# EAGLE schematic CAN Transceiver (EAGLE 9.0.1)
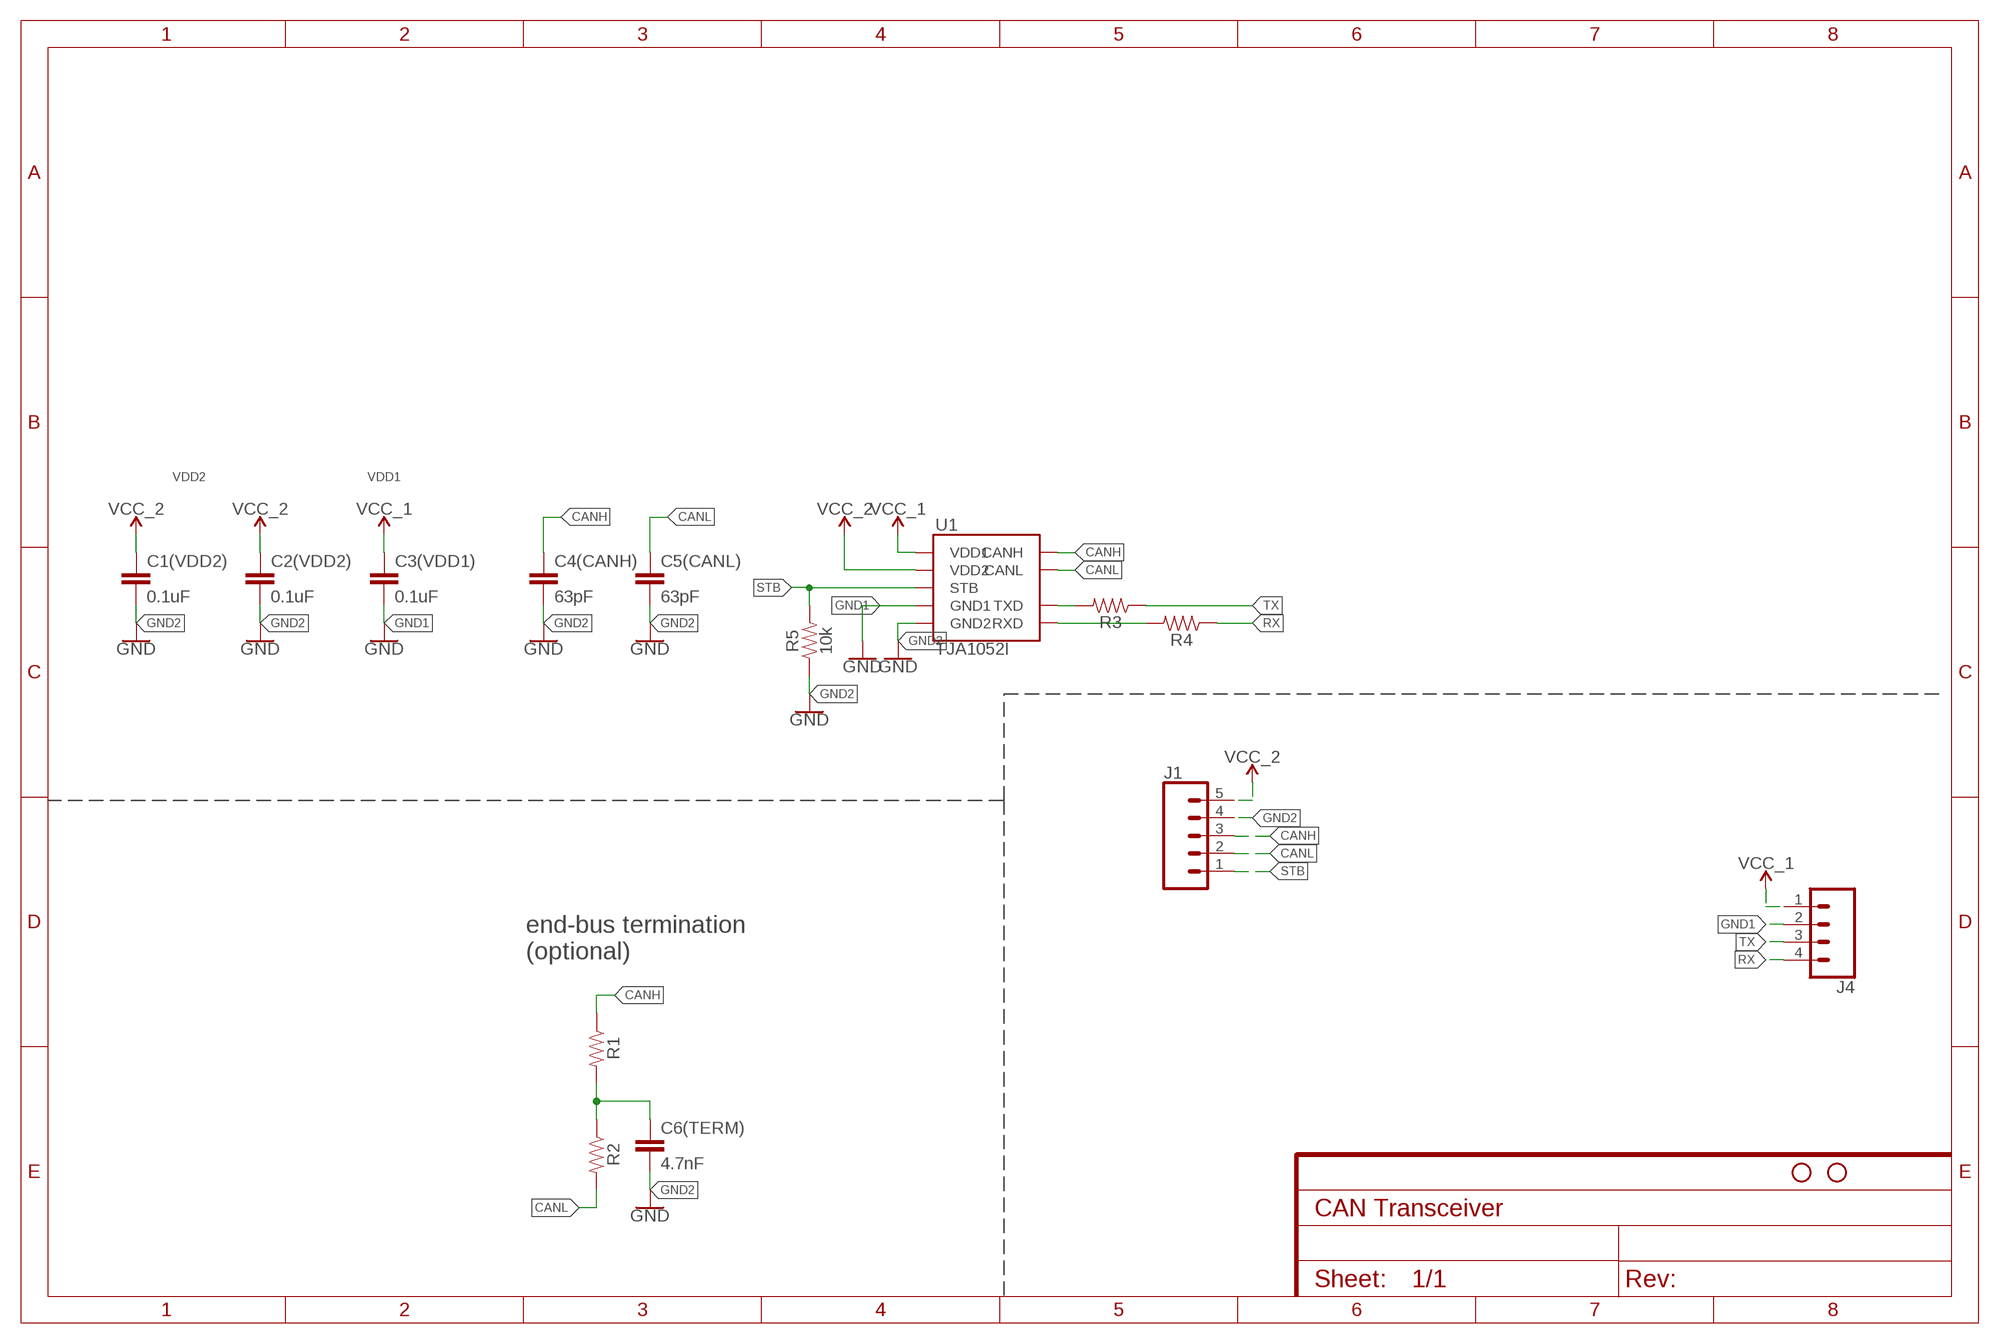
[diagram p0: schematic, sheet 1]

## Parts
C1(VDD2)  0.1uF  0.1UF-0603-25V-(+80/-20%)  [0603]
C2(VDD2)  0.1uF  0.1UF-0603-25V-(+80/-20%)  [0603]
C3(VDD1)  0.1uF  0.1UF-0603-25V-(+80/-20%)  [0603]
C4(CANH)  63pF  390NF-0603-10V-10%  [0603]
C5(CANL)  63pF  390NF-0603-10V-10%  [0603]
C6(TERM)  4.7nF  390NF-0603-10V-10%  [0603]
H1  STAND-OFF  [STAND-OFF]
H3  STAND-OFF  [STAND-OFF]
J1  CONN_05  [1X05]
J4  CONN_04  [1X04]
R1  RESISTOR0603  [0603]
R2  RESISTOR0603  [0603]
R3  RESISTOR0603  [0603]
R4  RESISTOR0603  [0603]
R5  10k  10KOHM-0603-1/10W-1%  [0603]
U1  TJA1052I  [SO16]

## Nets
CANH: C4(CANH).1 J1.3 R1.1 U1.13(CANH)
CANL: C5(CANL).1 J1.2 R2.2 U1.12(CANL)
GND1: C3(VDD1).2 J4.2 U1.2(GND1) U1.7(GND1) U1.8(GND1) ; supply symbol labelled GND
GND2: C1(VDD2).2 C2(VDD2).2 C4(CANH).2 C5(CANL).2 C6(TERM).2 J1.4 R5.1 U1.9(GND2) U1.10(GND2) U1.15(GND2) ; supply symbol labelled GND
N$1: R3.2 U1.3(TXD)
N$2: R4.2 U1.5(RXD)
N$3: C6(TERM).1 R1.2 R2.1
RX: J4.4 R4.1
STB: J1.1 R5.2 U1.14(STB)
TX: J4.3 R3.1
VCC_1: C3(VDD1).1 J4.1 U1.1(VDD1)
VCC_2: C1(VDD2).1 C2(VDD2).1 J1.5 U1.11(VDD2) U1.16(VDD2)

## Notes on the sheet
- VDD2 | VDD1
- end-bus termination
  (optional)

## Library data of the parts
C1(VDD2) C2(VDD2) C3(VDD1) = SparkFun-Capacitors:0.1UF: 0.1µF ceramic capacitors A capacitor is a passive two-terminal electrical component used to store electrical energy temporarily in an electric field.; PROD_ID: CAP-00810
C4(CANH) C5(CANL) C6(TERM) = SparkFun-Capacitors:390NF: 0.39uF/390nF ceramic capacitors A capacitor is a passive two-terminal electrical component used to store electrical energy temporarily in an electric field.; PROD_ID: CAP-10986; VALUE: 390nF
H1 H3 = SparkFun-Hardware:STAND-OFF: Stand Off Drill holes for mechanically mounting via screws, standoffs, etc. Note: Use the keepout ring to avoid running the screw head into surrounding components. Variant Overviews STAND-OFF - Mechanical footprint for a #4 phillips button head screw. STAND-OFF-TIGHT - Mechanical footprint for a #4 phillips button head screw, Example SparkFun Products Screw - Phillips Head (1/4", 4-40, 10 pack) <https://www.sparkfun.com/products/10453> (PRT-10453) Screw - Phillips Head (1/2", 4-40, 10 pack) <https://www.sparkfun.com/products/10452> (PRT-10452) Screw - Phillips Head (3/4", 4-40, 10 pack) <https://www.sparkfun.com/products/10451> (PRT-10451) Screw - Phillips Head (1", 4-40, 10 pack) <https://www.sparkfun.com/products/10450> (PRT-10450)
J1 = SparkFun-Connectors:CONN_05: Multi connection point. Often used as Generic Header-pin footprint for 0.1 inch spaced/style header connections On any of the 0.1 inch spaced packages, you can populate with these: Break Away Headers - Straight <https://www.sparkfun.com/products/116> (PRT-00116) Break Away Male Headers - Right Angle <https://www.sparkfun.com/products/553> (PRT-00553) Female Headers <https://www.sparkfun.com/products/115> (PRT-00115) Break Away Headers - Machine Pin <https://www.sparkfun.com/products/117> (PRT-00117) Break Away Female Headers - Swiss Machine Pin <https://www.sparkfun.com/products/743> (PRT-00743) For SCREWTERMINALS and SPRING TERMINALS visit here: Screw Terimnals on SparkFun.com <https://www.sparkfun.com/search/results?term=Screw+Terminals> (5mm/3.5mm/2.54mm spacing) This device is also useful as a general connection point to wire up your design to another part of your project. Our various solder wires solder well into these plated through hole pads. Hook-Up Wire - Assortment (Stranded, 22 AWG) <https://www.sparkfun.com/products/11375> (PRT-11375) Hook-Up Wire - Assortment (Solid Core, 22 AWG) <https://www.sparkfun.com/products/11367> (PRT-11367) View the entire wire category on our website here <https://www.sparkfun.com/categories/141> Special notes: Molex polarized connector foot print use with SKU : PRT-08231 with associated crimp pins and housings. 1MM SMD Version SKU: PRT-10208
J4 = SparkFun-Connectors:CONN_04: Multi connection point. Often used as Generic Header-pin footprint for 0.1 inch spaced/style header connections On any of the 0.1 inch spaced packages, you can populate with these: Break Away Headers - Straight <https://www.sparkfun.com/products/116> (PRT-00116) Break Away Male Headers - Right Angle <https://www.sparkfun.com/products/553> (PRT-00553) Female Headers <https://www.sparkfun.com/products/115> (PRT-00115) Break Away Headers - Machine Pin <https://www.sparkfun.com/products/117> (PRT-00117) Break Away Female Headers - Swiss Machine Pin <https://www.sparkfun.com/products/743> (PRT-00743) For SCREWTERMINALS and SPRING TERMINALS visit here: Screw Terimnals on SparkFun.com <https://www.sparkfun.com/search/results?term=Screw+Terminals> (5mm/3.5mm/2.54mm spacing) This device is also useful as a general connection point to wire up your design to another part of your project. Our various solder wires solder well into these plated through hole pads. Hook-Up Wire - Assortment (Stranded, 22 AWG) <https://www.sparkfun.com/products/11375> (PRT-11375) Hook-Up Wire - Assortment (Solid Core, 22 AWG) <https://www.sparkfun.com/products/11367> (PRT-11367) View the entire wire category on our website here <https://www.sparkfun.com/categories/141> Special notes: Molex polarized connector foot print use with SKU : PRT-08231 with associated crimp pins and housings. 1MM SMD Version SKU: PRT-10208; PROD_ID: CONN-09696
R1-R4 = SparkFun-Resistors:RESISTOR: Generic Resistor Package
R5 = SparkFun-Resistors:10KOHM: 10kΩ resistor A resistor is a passive two-terminal electrical component that implements electrical resistance as a circuit element. Resistors act to reduce current flow, and, at the same time, act to lower voltage levels within circuits. - Wikipedia; PROD_ID: RES-00824
U1 = CU_Electric_Car:TJA1052I